# EAGLE design onekeyboard_1 (EAGLE 9.5.1)

## Sheet 1 of 2
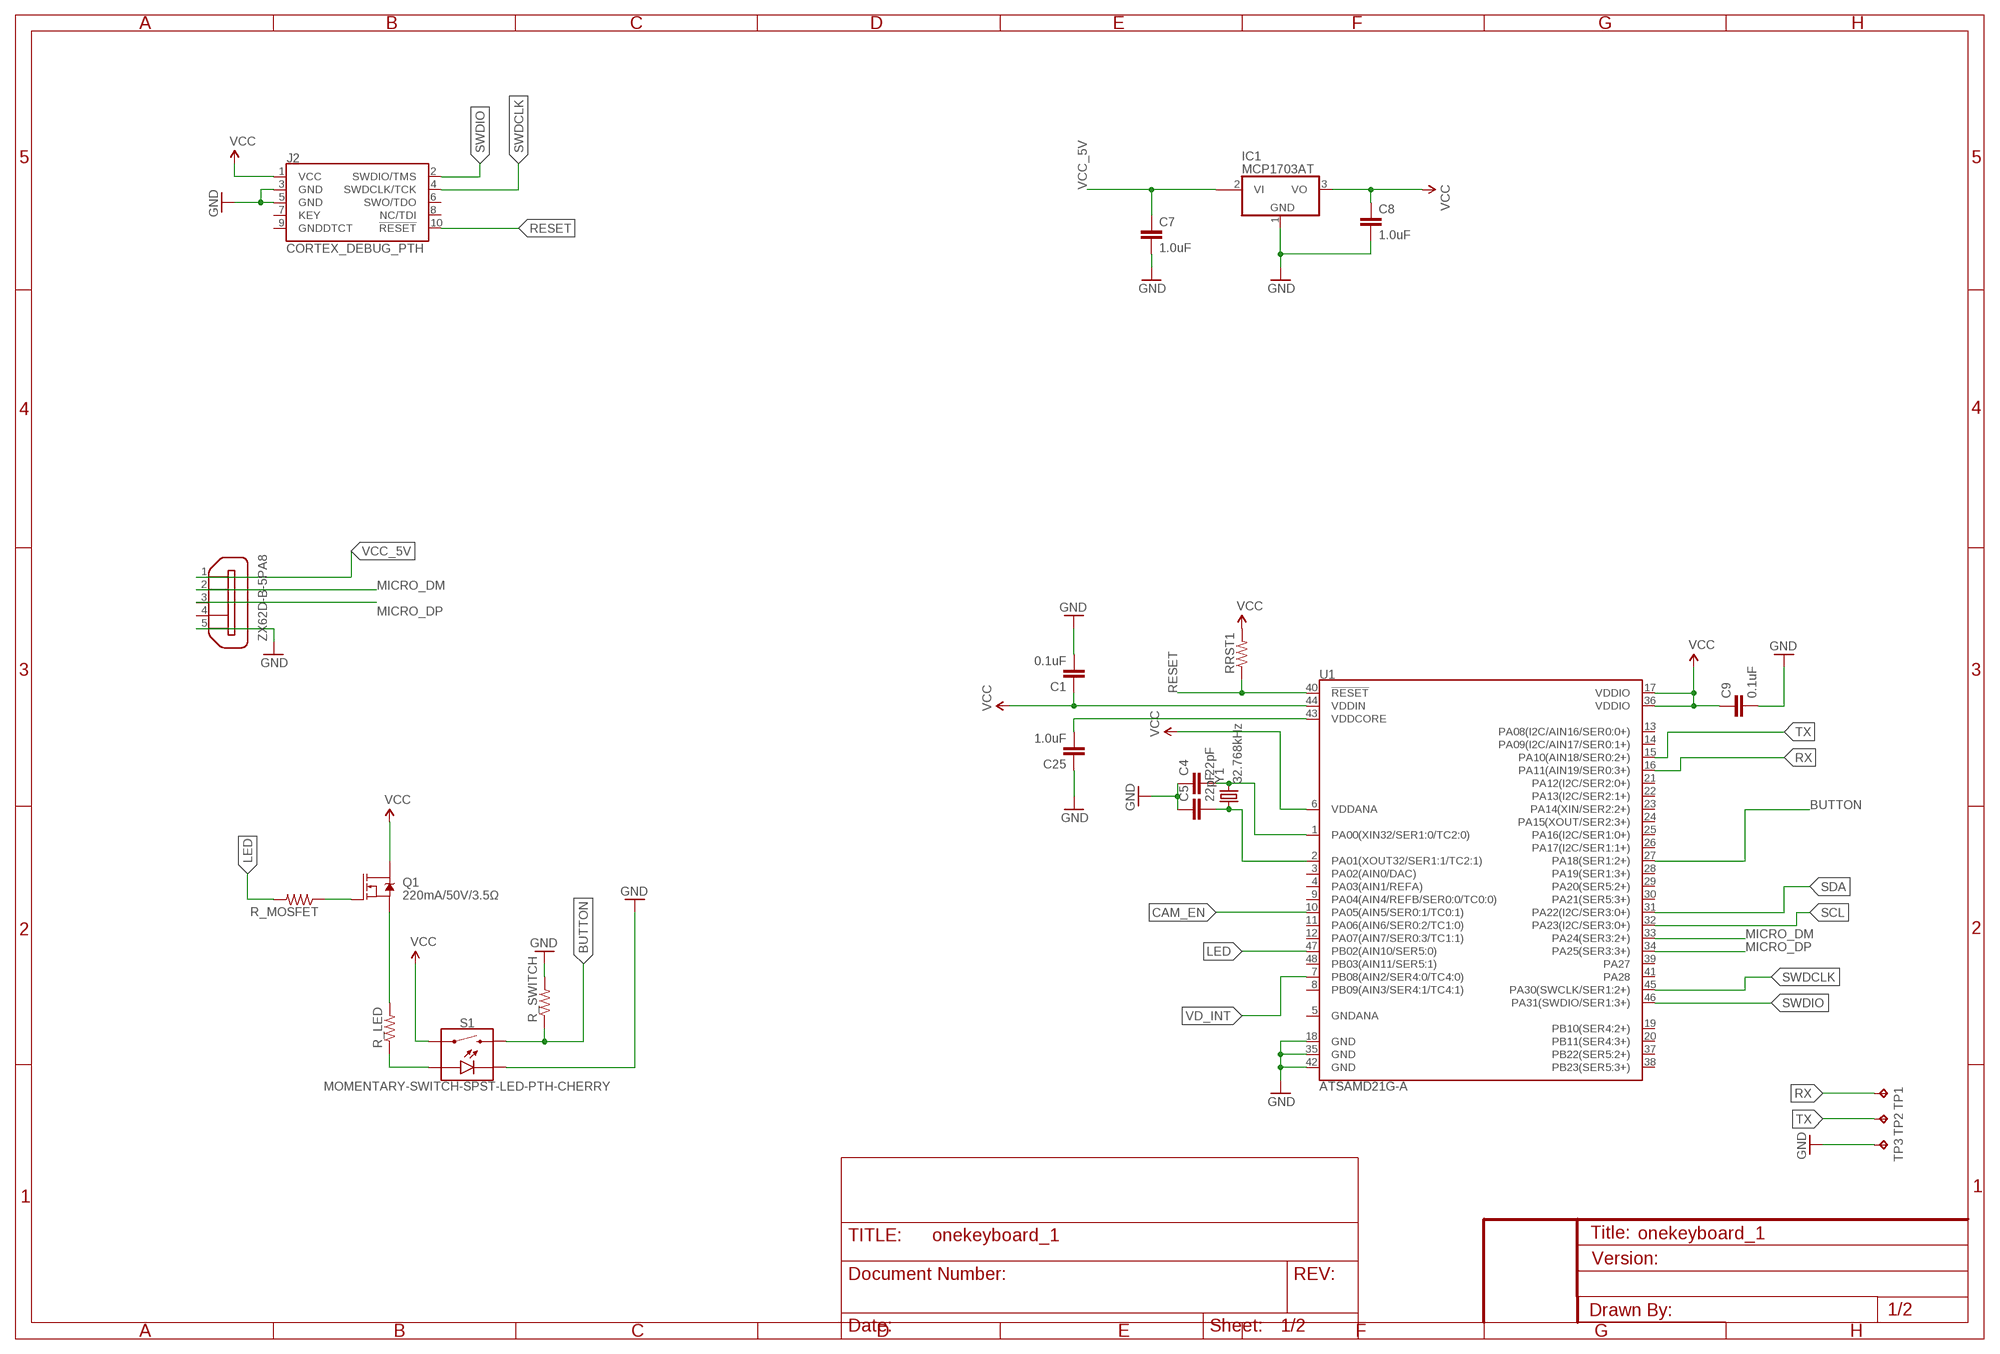
[diagram p0: schematic, sheet 1]

### Parts
C1  0.1uF  1.0UF-0805-25V-10%  [0805]
C4  22pF  CAP0805  [0805]
C5  22pF  CAP0805  [0805]
C7  1.0uF  1.0UF-1206-50V-10%  [1206]
C8  1.0uF  1.0UF-1206-50V-10%  [1206]
C9  0.1uF  1.0UF-0805-25V-10%  [0805]
C25  1.0uF  1.0UF-0805-25V-10%  [0805]
IC1  MCP1703AT  MCP170312MB  [SOT89]
J2  CORTEX_DEBUG_PTH  [2X5-PTH-1.27MM]
Q1  220mA/50V/3.5Ω  MOSFET-NCH-BSS138  [SOT23-3]
R_LED  RESISTOR0805-RES  [0805]
R_MOSFET  RESISTOR0805-RES  [0805]
R_SWITCH  RESISTOR0805-RES  [0805]
RRST1  RESISTOR0805-RES  [0805]
S1  MOMENTARY-SWITCH-SPST-LED-PTH-CHERRY  [CHERRY-MX-LED]
TP1  TPB2,54  [B2,54]
TP2  TPB2,54  [B2,54]
TP3  TPB2,54  [B2,54]
U1  ATSAMD21G-A  [TQFP-48]
X2  ZX62D-B-5PA8  [ZX62D-B-5PA8]
Y1  32.768kHz  CRYSTAL3.2X1.5MM  [CRYSTAL-SMD-3.2X1.5MM]

### Nets
BUTTON: R_SWITCH.1 S1.S2 U1.27(PA18(SER1:2+))
CAM_EN: U1.10(PA05(AIN5/SER0:1/TC0:1))
GND: C1.2 C4.1 C5.1 C7.2 C8.2 C9.2 C25.1 IC1.1(GND) J2.3(GND) J2.5(GND) R_SWITCH.2 S1.K(C) TP3.TP U1.18(GND) U1.35(GND) U1.42(GND) X2.5
LED: R_MOSFET.2 U1.47(PB02(AIN10/SER5:0))
MICRO_DM: U1.33(PA24(SER3:2+)) X2.2
MICRO_DP: U1.34(PA25(SER3:3+)) X2.3
N$1: Q1.2(S) R_LED.2
N$2: Q1.1(G) R_MOSFET.1
N$4: R_LED.1 S1.A
N$5: C25.2 U1.43(VDDCORE)
N$8: C4.2 U1.1(PA00(XIN32/SER1:0/TC2:0)) Y1.P$2
N$32: C5.2 U1.2(PA01(XOUT32/SER1:1/TC2:1)) Y1.P$1
RESET: J2.10(!RESET) RRST1.1 U1.40(!RESET!)
RX: TP1.TP U1.16(PA11(AIN19/SER0:3+))
SCL: U1.32(PA23(I2C/SER3:0+))
SDA: U1.31(PA22(I2C/SER3:0+))
SWDCLK: J2.4(SWDCLK/TCK) U1.45(PA30(SWCLK/SER1:2+))
SWDIO: J2.2(SWDIO/TMS) U1.46(PA31(SWDIO/SER1:3+))
TX: TP2.TP U1.15(PA10(AIN18/SER0:2+))
VCC [power]: C1.1 C8.1 C9.1 IC1.3(VO) J2.1(VCC) Q1.3(D) RRST1.2 S1.S1 U1.6(VDDANA) U1.17(VDDIO) U1.36(VDDIO) U1.44(VDDIN)
VCC_5V [power]: C7.1 IC1.2@1(VI1) X2.1
VD_INT: U1.7(PB08(AIN2/SER4:0/TC4:0))
Unconnected: IC1.2(VI) J2.6(SWO/TDO) J2.7(KEY) J2.8(NC/TDI) J2.9(GNDDTCT) U1.3(PA02(AIN0/DAC)) U1.4(PA03(AIN1/REFA)) U1.5(GNDANA) U1.8(PB09(AIN3/SER4:1/TC4:1)) U1.9(PA04(AIN4/REFB/SER0:0/TC0:0)) U1.11(PA06(AIN6/SER0:2/TC1:0)) U1.12(PA07(AIN7/SER0:3/TC1:1)) U1.13(PA08(I2C/AIN16/SER0:0+)) U1.14(PA09(I2C/AIN17/SER0:1+)) U1.19(PB10(SER4:2+)) U1.20(PB11(SER4:3+)) U1.21(PA12(I2C/SER2:0+)) U1.22(PA13(I2C/SER2:1+)) U1.23(PA14(XIN/SER2:2+)) U1.24(PA15(XOUT/SER2:3+)) U1.25(PA16(I2C/SER1:0+)) U1.26(PA17(I2C/SER1:1+)) U1.28(PA19(SER1:3+)) U1.29(PA20(SER5:2+)) U1.30(PA21(SER5:3+)) U1.37(PB22(SER5:2+)) U1.38(PB23(SER5:3+)) U1.39(PA27) U1.41(PA28) U1.48(PB03(AIN11/SER5:1)) X2.4 X2.S1 X2.S2 X2.S3 X2.S4

## Sheet 2 of 2

## Library data of the parts
C1 C9 = SparkFun-Capacitors:1.0UF: 1µF ceramic capacitors A capacitor is a passive two-terminal electrical component used to store electrical energy temporarily in an electric field.; PROD_ID: CAP-08064; VALUE: 1.0uF
C4 C5 = SparkFun-Passives:CAP: Capacitor Standard 0603 ceramic capacitor, and 0.1" leaded capacitor.
C7 C8 = SparkFun-Capacitors:1.0UF: 1µF ceramic capacitors A capacitor is a passive two-terminal electrical component used to store electrical energy temporarily in an electric field.; PROD_ID: CAP-09822
C25 = SparkFun-Capacitors:1.0UF: 1µF ceramic capacitors A capacitor is a passive two-terminal electrical component used to store electrical energy temporarily in an electric field.; PROD_ID: CAP-08064
IC1 = linear:MCP1703*: 250 mA, 16V, Low Quiescent Current LDO Regulator Source: http://ww1.microchip.com/downloads/en/DeviceDoc/22049b.pdf
J2 = SparkFun-Connectors:CORTEX_DEBUG: Cortex Debug Connector - 10 pin Supports JTAG debug, Serial Wire debug, and Serial Wire Viewer. PTH and SMD connector options available. General Connector Information <http://infocenter.arm.com/help/topic/com.arm.doc.faqs/attached/13634/cortex_debug_connectors.pdf> Products: PTH Connector <http://www.digikey.com/product-detail/en/cnc-tech/3220-10-0100-00/1175-1627-ND/3883661> -via Digi-Key SparkFun PSoc <https://www.sparkfun.com/products/13229> SparkFun T <https://www.sparkfun.com/products/13810>
Q1 = SparkFun-DiscreteSemi:MOSFET-NCH: N-channel MOSFETs Voltage controlled devices that allow control of high current outputs. SparkFun Products: SparkFun OpenScale <https://www.sparkfun.com/products/13261> SparkFun Digital Sandbox <https://www.sparkfun.com/products/12651> SparkFun Monster Moto Shield <https://www.sparkfun.com/products/10182> SparkFun MOSFET Power Controller <https://www.sparkfun.com/products/11214>; PROD_ID: TRANS-00830
R_LED R_MOSFET R_SWITCH RRST1 = SparkFun-Passives:RESISTOR: Resistor Basic schematic elements and footprints for 0603, 1206, and PTH resistors.
S1 = SparkFun-Switches:MOMENTARY-SWITCH-SPST-LED: Momentary Switch (Pushbutton) - SPST - w/ LED Normally-open (NO) SPST momentary switches (buttons, pushbuttons), with a built-in LED. Variants PTH-CHERRY - Cherry MX Switch Cherry MX Keyswitches are top-of-the-line mechanical keyboard switches. They’re satisfyingly “clicky”, reliable up to tens-of-millions of key presses, and a standard in gaming and programming keyboards across the globe. This ‘blue’ version Cherry MX Switch is favored by most due to its secondary internal actuator making it less likely to “double-tap.” If you are looking for a noticeably audible and high-quality key switch, this is the perfect option for you! Cherry MX Switch <https://www.sparkfun.com/products/13834> (COM-13834) Cherry MX Switch Breakout <https://www.sparkfun.com/products/13773> (BOB-13773) PTH-12MM and PTH-12MM-KIT - 12mm Illuminated LED KIT variant is for soldering kits. There is no tStop (covering up the top side of the pads with mask). This helps the beginner see which side they should be soldering too. LED Tactile Button Breakout <https://www.sparkfun.com/products/10467> (BOB-10467) LED Tactile Button - Red <https://www.sparkfun.com/products/10442> (COM-10442) LED Tactile Button - Blue <https://www.sparkfun.com/products/10443> (COM-10443) LED Tactile Button - Green <https://www.sparkfun.com/products/10440> (COM-10440) LED Tactile Button - Orange <https://www.sparkfun.com/products/10441> (COM-10441) LED Tactile Button - White <https://www.sparkfun.com/products/10439> (COM-10439); SF_ID: COM-13834
TP1-TP3 = testpad:TP: Test pad
U1 = SparkFun-IC-Microcontroller:ATSAMD21G: Atmel SAMD21G SMART ARM-Based Microcontroller The Atmel ® | SMART ™ SAM D21 is a series of low-power microcontrollers using the 32-bit ARM ® Cortex ® -M0+ processor, and ranging from 32- to 64-pins with up to 256KB Flash and 32KB of SRAM. The SAM D21 devices operate at a maximum frequency of 48MHz and reach 2.46 CoreMark/MHz. They are designed for simple and intuitive migration with identical peripheral modules, hex compatible code, identical linear address map and pin compatible migration paths between all devices in the product series. All devices include intelligent and flexible peripherals, Atmel Event System for inter-peripheral signaling, and support for capacitive touch button, slider and wheel user interfaces. Datasheet <https://cdn.sparkfun.com/datasheets/Dev/Arduino/Boards/Atmel-42181-SAM-D21_Datasheet.pdf> SparkFun Products SparkFun SAMD21 Mini Breakout <https://www.sparkfun.com/products/13664> (DEV-13664) SparkFun SAMD21 Dev Breakout <https://www.sparkfun.com/products/13672> (DEV-13672); PROD_ID: IC-13064
X2 = zx62d-b-5pa8-oshpark_10:ZX62D-B-5PA8: Micro USB Type B Connector - Standard, Shell Through Hole Source: http://www.hirose.co.jp/cataloge_hp/ed_ZX_20140804.pdf; MF: Hirose; MPN: ZX62D-B-5PA8; OC_FARNELL: 2300438; OC_NEWARK: 69W0712
Y1 = SparkFun-FreqCtrl:CRYSTAL: Various standard crystals. Proven footprints.; PROD_ID: XTAL-13062

## Net classes
0 default: width 0.254 mm, clearance 0.152 mm
1 power: width 0.254 mm, clearance 0.254 mm
2 hub_power: width 0.584 mm, clearance 0.254 mm
3 usbsignal: width 0.254 mm, clearance 0.203 mm
4 highpower: clearance 0.305 mm

## Board
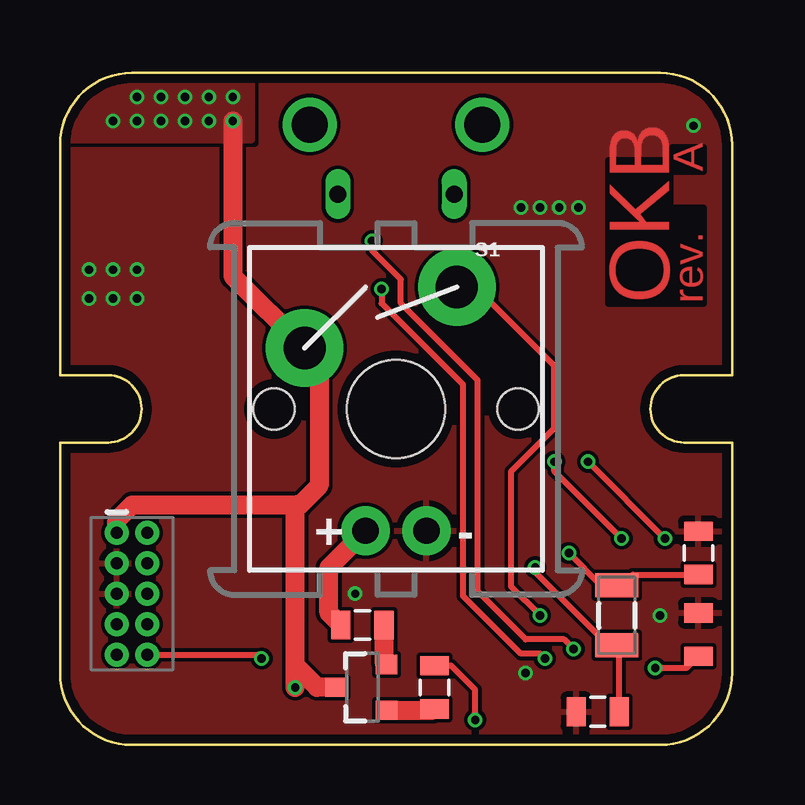
[diagram p1: board, top side]
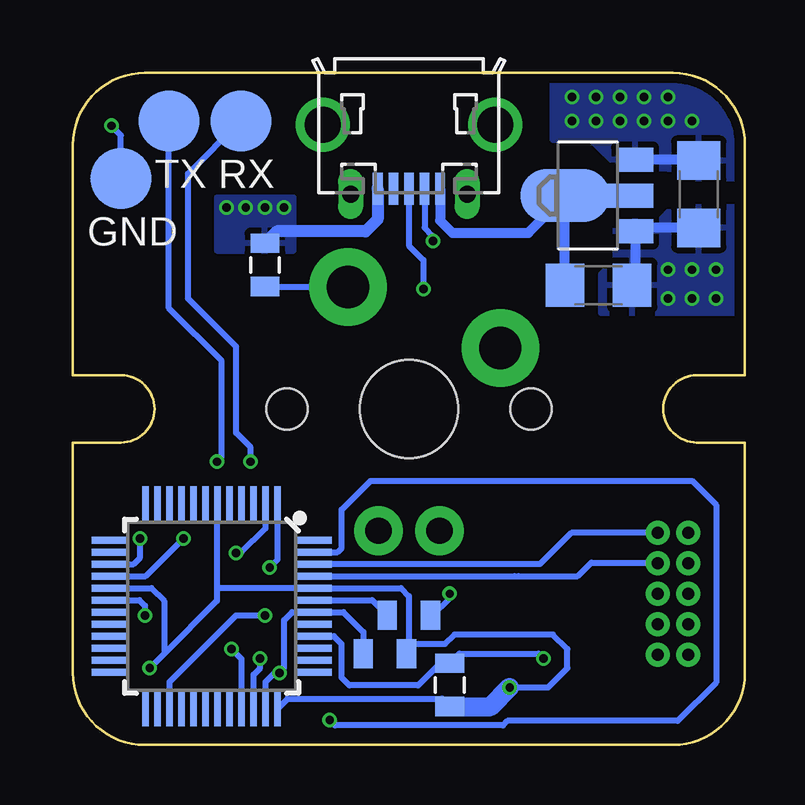
[diagram p2: board, bottom side, seen from below]

Size 28 x 28 mm. Coordinates in mm from the lower left corner, seen from the top.
Outline: 25,28 3,28 arc90 0,25 0,15.4 2,15.4 arc-180 2,12.6 0,12.6 0,3 arc90 3,0 25,0 arc90 28,3 28,12.6 26,12.6 arc-180 26,15.4 28,15.4 28,25 arc90 25,28
Copper layers (1*16): Top 0.035559375mm / dielectric 1.6mm / Bottom 0.035559375mm
Design rules "oshpark-2layer": minimum track width 6mil, minimum drill 10mil, track to track 6mil, track to pad 6mil, pad to pad 6mil, via to via 6mil, smd to smd 6mil, copper to edge 15mil, drill to drill 6mil, minimum pad ring 5mil, minimum via ring 5mil, stop-mask expansion 2.5mil, vias tented up to drill 0mil, thermal gap 10mil

### Footprints (pad centres in the part's own frame; a part is rotated, then mirrored left to right if it is on the bottom)
0805 = smd 0.8 x 1.2: 1 -0.9,0; 2 0.9,0
1206 = smd 1.6 x 1.8: 1 -1.4,0; 2 1.4,0
SOT89 = smd 1 x 1.5: 1 -1.499,-1.981; 3 1.499,-1.981 | smd 1 x 2: 2 0,-1.727 | smd 2.2 x 3.7: 2@1 0,0.94
2X5-PTH-1.27MM = drill 0.508 pad 1: 1 -2.54,-0.635; 2 -2.54,0.635; 3 -1.27,-0.635; 4 -1.27,0.635; 5 0,-0.635; 6 0,0.635; 7 1.27,-0.635; 8 1.27,0.635; 9 2.54,-0.635; 10 2.54,0.635
SOT23-3 = smd 0.8 x 0.9: 1 -0.95,-1; 2 0.95,-1; 3 0,1.1
CHERRY-MX-LED = drill 1.092 pad 2.032: A -1.27,-5.08; K 1.27,-5.08 | drill 1.753 pad 3.226: S1 -3.81,2.54; S2 2.54,5.08 | hole 4.089: 0,0 | hole 1.707: -5.08,0; 5.08,0
B2,54 = smd 2.54 x 2.54: TP 0,0
TQFP-48 = smd 1.5 x 0.28: 1 -4.25,2.75; 2 -4.25,2.25; 3 -4.25,1.75; 4 -4.25,1.25; 5 -4.25,0.75; 6 -4.25,0.25; 7 -4.25,-0.25; 8 -4.25,-0.75; 9 -4.25,-1.25; 10 -4.25,-1.75; 11 -4.25,-2.25; 12 -4.25,-2.75; 25 4.25,-2.75; 26 4.25,-2.25; 27 4.25,-1.75; 28 4.25,-1.25; 29 4.25,-0.75; 30 4.25,-0.25; 31 4.25,0.25; 32 4.25,0.75; 33 4.25,1.25; 34 4.25,1.75; 35 4.25,2.25; 36 4.25,2.75 | smd 0.28 x 1.5: 13 -2.75,-4.25; 14 -2.25,-4.25; 15 -1.75,-4.25; 16 -1.25,-4.25; 17 -0.75,-4.25; 18 -0.25,-4.25; 19 0.25,-4.25; 20 0.75,-4.25; 21 1.25,-4.25; 22 1.75,-4.25; 23 2.25,-4.25; 24 2.75,-4.25; 37 2.75,4.25; 38 2.25,4.25; 39 1.75,4.25; 40 1.25,4.25; 41 0.75,4.25; 42 0.25,4.25; 43 -0.25,4.25; 44 -0.75,4.25; 45 -1.25,4.25; 46 -1.75,4.25; 47 -2.25,4.25; 48 -2.75,4.25
ZX62D-B-5PA8 = smd 1.35 x 0.4: 1 4.825,1.3; 2 4.825,0.65; 3 4.825,0; 4 4.825,-0.65; 5 4.825,-1.3 | drill 1.5: S1 2.15,-3.6; S2 2.15,3.6 | drill 0.7 long: S3 5.05,2.425; S4 5.05,-2.425
CRYSTAL-SMD-3.2X1.5MM = smd 1 x 1.8: P$1 -1.25,0; P$2 1.25,0

### Placement (x,y rotation side)
C1  15,3.8 180 bottom
C4  22.41,1.38 0 top
C5  26.6,8 270 top
C7  6.1,19.16 0 bottom
C8  1.93,22.95 270 bottom
C9  26.6,4.6 90 top
C25  14,5.4 180 bottom
IC1  6.56,22.89 90 bottom
J2  3,6.3 270 top
Q1  12.6,2.4 90 top
R_LED  12.6,5 0 top
R_MOSFET  15.6,2.4 90 top
R_SWITCH  20,20 90 bottom
RRST1  12.3,2.5 270 bottom
S1  14,14 0 top
TP1  21,26 0 bottom
TP2  24,26 0 bottom
TP3  26,23.6 0 bottom
U1  22.22,5.78 270 bottom
X2  14,28 270 bottom
Y1  23.2,5.4 270 top

### Tracks (layer width: path | path; a pad name or v marks a point on that pad's centre or on a via)
BUTTON  (via drill 0.35)
  Top 0.254: v20,5.4 18.8,6.6 18.8,11.4 20.6,13.2 20.6,15.8 17.32,19.08 S1.S2
  Bottom 0.254: S1.S2 19.98,19.08 R_SWITCH.1 | U1.27 23.97,2.63 21.2,5.4 v20,5.4
GND  (via drill 0.35)
  Bottom 0.254: C1.2 15.9,4.7 16.73,5.53 U1.42 18.87,5.53 19.2,5.2 19.2,3.2 v19.4,3 19.6,3 19.97,2.63 U1.35 | C25.1 13,5.4 12.3,6.1 v12.3,6.3 | TP3.TP 26,25.4 v26.4,25.8 | U1.18 25.23,6.03 25,5.8 v25,5.4
  Bottom 0.406: C8.2 4.42,21.55 IC1.1 4.58,19.28 C7.2
  Bottom 0.5: X2.5 15.3,21.9 15.8,21.4 19.5,21.4 R_SWITCH.2
  other vias: 1.2,19.8 1.2,18.6 2.2,18.6 2.2,19.8 3.2,19.8 3.2,18.6 19.2,22.4 20,22.4 20.8,22.4 21.6,22.4
  pour Top (rank 2): 0,0 28,0 28,28 0,28
  pour Bottom: 6,18 0,18 0,22.2 0,22.4 2.8,22.4 3,22.4 3.6,21.8 5.4,21.8 5.4,20.2 6,19.6
  pour Bottom: 22,20.6 18.8,20.6 18.8,22.8 22,22.8
LED  (via drill 0.35)
  Top 0.254: v17.3,1.05 17.3,2.3 16.3,3.3 R_MOSFET.2
  Bottom 0.254: U1.47 16.97,8.03 16.8,8.2 16.8,9.8 15.6,11 2.2,11 1.2,10 1.2,2.6 2.8,1 9.89,1 10.08,0.82 17.07,0.82 v17.3,1.05
MICRO_DM  (via drill 0.35)
  Top 0.254: v21.4,4 21,4.4 19.4,4.4 17.4,6.4 17.4,15.2 14.2,18.4 14.2,19.4 13,20.6 v13,21
  Bottom 0.254: U1.33 20.97,3.57 v21.4,4 | X2.2 13.35,21.55 13,21.2 v13,21
MICRO_DP  (via drill 0.35)
  Top 0.254: v13.4,19 13.4,18.4 16.8,15 16.8,6.2 19.2,3.8 20,3.8 v20.2,3.6
  Bottom 0.254: v13.4,19 13.4,20.2 14,20.8 X2.3 | U1.34 20.47,2.93 20.2,3.2 v20.2,3.6
N$1
  Top 0.8: Q1.2 13.5,3.45 R_LED.2
N$2
  Top 0.8: Q1.1 15.55,1.45 R_MOSFET.1
N$4
  Top 0.8: R_LED.1 11.2,5.5 11.2,7.39 S1.A
N$5
  Bottom 0.254: U1.43 15.53,6.03 C25.2
N$8  (via drill 0.35)
  Top 0.254: v19.8,7.4 19.8,7.2 22.84,4.16 Y1.P$2 23.31,4.04 C4.2
  Bottom 0.254: v19.8,7.4 19.47,7.73 U1.1
N$32  (via drill 0.35)
  Top 0.254: v21.2,8 22.54,6.66 Y1.P$1 23.87,7.1 C5.2
  Bottom 0.254: v21.2,8 21,8 19.97,9.03 U1.2
RESET  (via drill 0.35)
  Top 0.254: J2.10 8.24,3.76 v8.4,3.6
  Bottom 0.254: U1.40 17.13,4.53 16.8,4.2 16.8,2.8 16.49,2.49 13.61,2.49 12.7,3.4 RRST1.1 11.9,3.8 8.6,3.8 v8.4,3.6
RX  (via drill 0.35)
  Top 0.254: v20.6,11.8 20.6,11.4 v23.4,8.6
  Bottom 0.254: U1.16 24.97,7.03 v23.4,8.6 | v20.6,11.8 20.6,12.4 21.2,13 21.2,16.6 23.2,18.6 23.2,23.8 TP1.TP
SWDCLK
  Bottom 0.254: U1.45 9.6,7.03 9.43,7.03 6.97,7.03 6.4,7.6 3.67,7.6 J2.4
SWDIO
  Bottom 0.254: U1.46 8.55,7.53 7.24,8.84 J2.2
TX  (via drill 0.35)
  Top 0.254: v25.2,8.6 v22,11.8
  Bottom 0.254: U1.15 25.47,7.53 25.2,7.8 v25.2,8.6 | v22,11.8 21.8,12 21.8,16 24,18.2 TP2.TP
VCC  (via drill 0.35)
  Top 0.254: C9.1 26.1,3.2 v24.8,3.2
  Top 0.8: v7.2,26 7.2,19.53 S1.S1 10.8,15.93 10.8,10.8 10,10 9.8,10 | 9.8,3.32 9.8,10 | J2.1 2.37,9.37 3,10 9.8,10 | Q1.3 10.72,2.4 9.8,3.32 | v9.8,2.4 9.8,3.32
  Bottom 0.254: U1.6 22,10 22,6.53 | RRST1.2 12.63,1.93 19.05,1.93 19.45,1.53 U1.36 | 14,4.2 12.5,4.2 12.1,4.6 8,4.6 7.4,4 7.4,3.2 8.2,2.4 v9.8,2.4 | C1.1 14,3.8 14,4.2 | 14,4.2 14,6.2 14.33,6.53 U1.44 22,6.53 | U1.17 24.73,6.53 24.2,6 24.2,3.8 | 24.2,3.8 v24.8,3.2 | 22,6.53 22,6 24.2,3.8
  Bottom 0.406: C8.1 1.97,24.39 IC1.3
  Bottom 0.8: RRST1.2 10.6,1.6 v9.8,2.4
  other vias: 2.2,26 3.2,27 3.2,26 4.2,26 4.2,27 5.2,26 5.2,27 6.2,27 6.2,26 7.2,27
  pour Bottom: 1.2,23.6 2.8,23.6 3.2,24 5.2,24 6.4,25.2 8,25.2 8,28 0,28 0,23.6
  pour Top: 0,25.2 8,25.2 8,28 0,28
VCC_5V
  Bottom 0.406: C7.1 7.5,22.86 | 7.5,22.86 IC1.2@1 | X2.1 12.7,21.84 12.19,21.34 9.03,21.34 7.5,22.86

### Text on the board
Top: A | OKB | rev.
bPlace: RX | TX | GND
tStop: A | OKB | rev.